# Altium project SimplicityToSkeddAdapter.PrjPcb
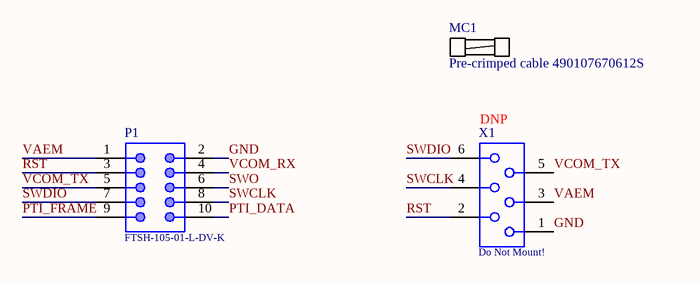
[diagram p0: SimplicityToSkeddAdapter.SchDoc]
1 sheet, 3 parts. Net scope: global (net labels, ports and power ports of the same name join across sheets).

## Sheet SimplicityToSkeddAdapter.SchDoc
size A4

### Parts
MC1  Pre-crimped cable 490107670612S
P1  FTSH-105-01-L-DV-K  [62101021021]
X1  Do Not Mount!  [490107670612_Permanent Application]  (no BOM)

### Nets
GND: P1.2 X1.1
PTI_DATA: P1.10
PTI_FRAME: P1.9
RST: P1.3 X1.2
SWCLK: P1.8 X1.4
SWDIO: P1.7 X1.6
SWO: P1.6
VAEM: P1.1 X1.3
VCOM_RX: P1.4
VCOM_TX: P1.5 X1.5

### Notes on the sheet
- (near X1) DNP

### Library data of the parts
MC1 = Fuse: Manufacturere: Wurth Elektronik; Part Number: 490107670612S
P1 = 62101021021: CONN HEADER SMD 10POS 1.27MM; Manufacturer: Samtec; Manufacturer Part Number: FTSH-105-01-L-DV-K
X1 = 490107670612: WR-WST REDFIT IDC SKEDD, pitch 2.54mm, 6pins; Pin Number: 6; Rated Current: 1A; Working Voltage: 100V(AC); Contact Resistance max.: 10mOhm; Gender: Transition; ComponentLink1Description: Manufacturer; ComponentLink1URL: http://www.we-online.de; ComponentLink2Description: Datasheet; ComponentLink2URL: https://katalog.we-online.com/em/datasheet/490107670612.pdf; Part Number: 490107670612; Published Date: November 2019; Publisher: Wurth Elektronik; Pitch: 2.54mm; Operating Temperature: -25 to +105degC; Mounting Technology: Press-In; Packaging: Tube